# Altium project PCB_Project1.PrjPCB
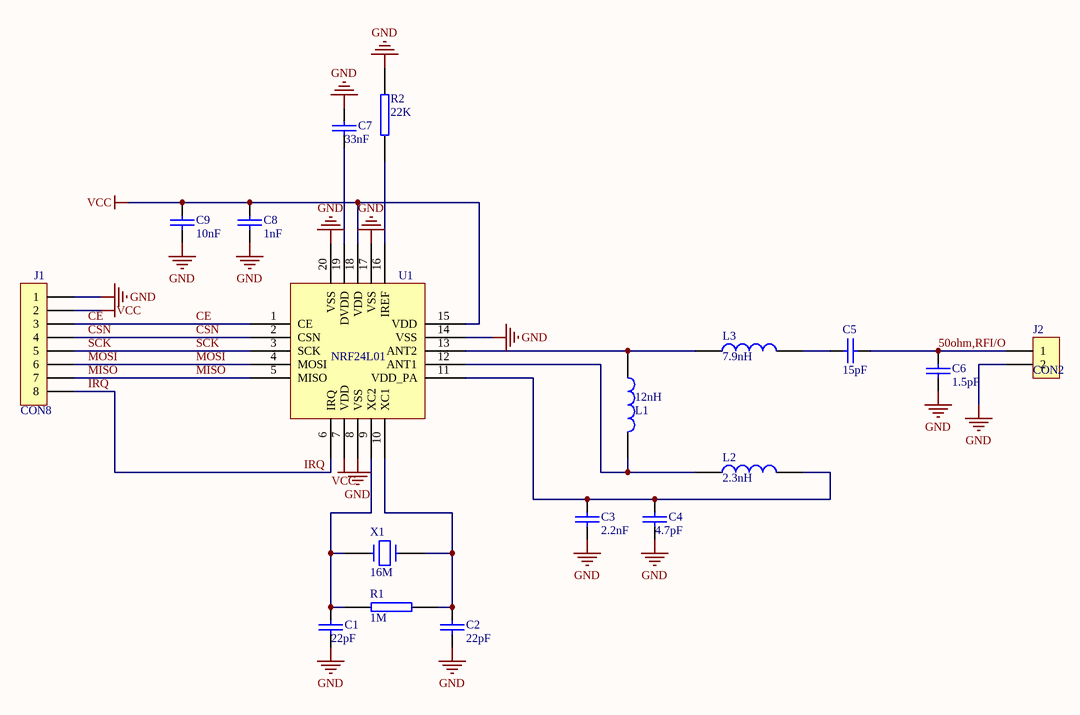
[diagram p0: Sheet1.SchDoc]
1 sheet, 18 parts. Net scope: global (net labels, ports and power ports of the same name join across sheets).
Board file: PCB1.PcbDoc

## Sheet Sheet1.SchDoc
size A4

### Parts
C1  22pF  [1608[0603]]
C2  22pF  [1608[0603]]
C3  2.2nF  [1608[0603]]
C4  4.7pF  [1608[0603]]
C5  15pF  [1608[0603]]
C6  1.5pF  [1608[0603]]
C7  33nF  [1608[0603]]
C8  1nF  [1608[0603]]
C9  10nF  [1608[0603]]
J1  CON8  [HDR2X4]
J2  CON2  [SMA]
L1  12nH  [1608[0603]]
L2  2.3nH  [1608[0603]]
L3  7.9nH  [1608[0603]]
R1  1M  [1608[0603]]
R2  22K  [1608[0603]]
U1  NRF24L01  [wifi]
X1  16M  [jingzhen]

### Nets
GND: C1.2 C2.2 C3.2 C4.2 C6.2 C7.1 C8.2 C9.2 J1.1 J2.2 R2.2 U1.8(VSS) U1.14(VSS) U1.17(VSS) U1.20(VSS)
VCC: C8.1 C9.1 J1.2 U1.7(VDD) U1.15(VDD) U1.18(VDD)
50ohm,RFI/O: C5.2 C6.1 J2.1
CE: J1.3 U1.1(CE)
CSN: J1.4 U1.2(CSN)
IRQ: J1.8 U1.6(IRQ)
MISO: J1.7 U1.5(MISO)
MOSI: J1.6 U1.4(MOSI)
SCK: J1.5 U1.3(SCK)
NetC1_1: C1.1 R1.1 U1.9(XC2) X1.1
NetC2_1: C2.1 R1.2 U1.10(XC1) X1.2
NetC3_1: C3.1 C4.1 L2.2 U1.11(VDD_PA)
NetC5_1: C5.1 L3.2
NetC7_2: C7.2 U1.19(DVDD)
NetL1_1: L1.1 L3.1 U1.13(ANT2)
NetL1_2: L1.2 L2.1 U1.12(ANT1)
NetR2_1: R2.1 U1.16(IREF)

### Library data of the parts
C1-C9 = CAP: Capacitor
J1 = CON8: Connector
J2 = CON2: Connector
L1-L3 = INDUCTOR
R1 R2 = RES2
X1 = CRYSTAL